# Altium project Motherboard_CMOS_MTJ_Biochip_v1.PrjPCB (part 2 of 2)

## Sheet CM Voltage Generator.SchDoc
size 406 x 203 mm
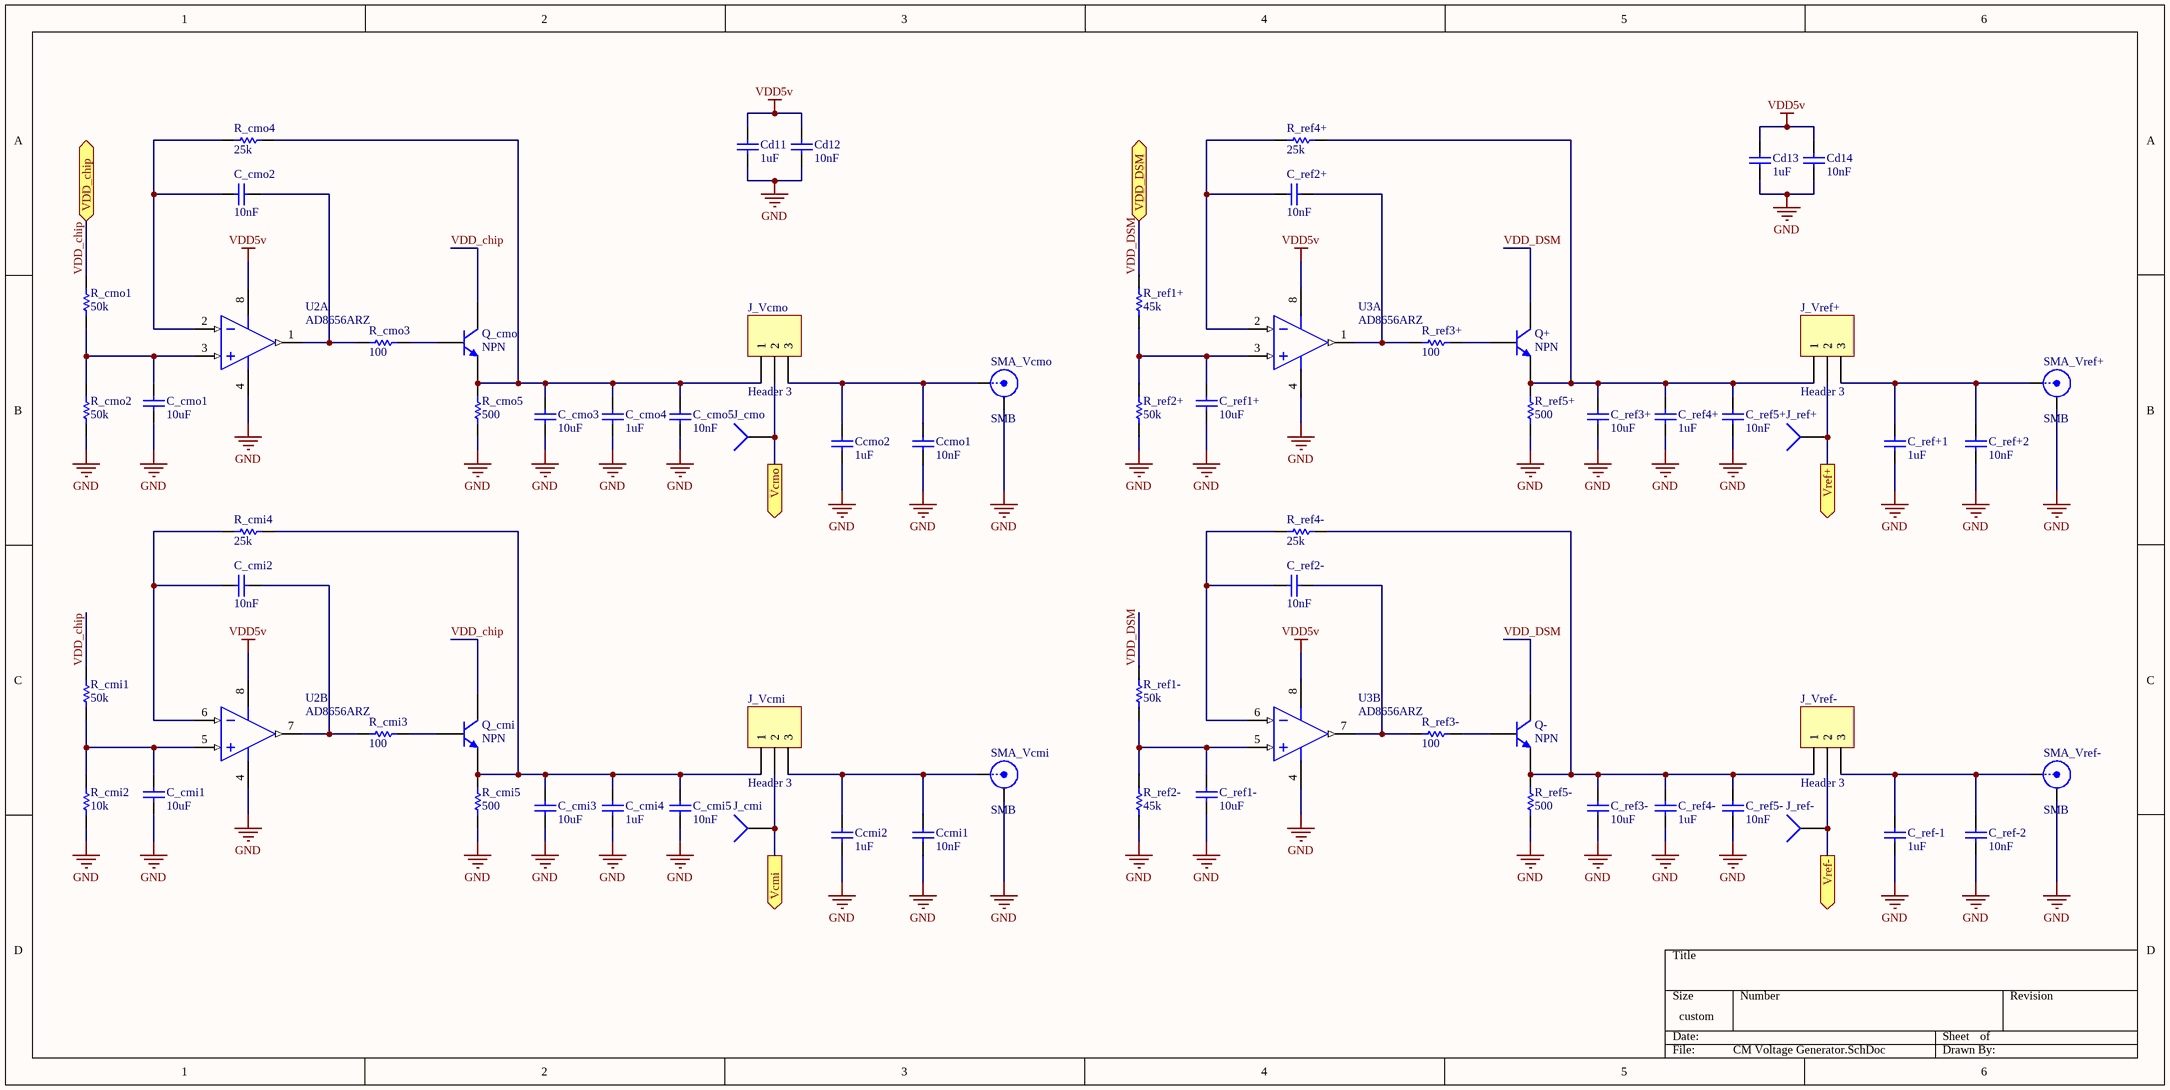
[diagram p5: CM Voltage Generator.SchDoc]

### Parts
C_cmi1  value 10uF  [1608[0603]]  (hidden comment: Cap)
C_cmi2  value 10nF  [1608[0603]]  (hidden comment: Cap)
C_cmi3  value 10uF  [1608[0603]]  (hidden comment: Cap)
C_cmi4  value 1uF  [1608[0603]]  (hidden comment: Cap)
C_cmi5  value 10nF  [1608[0603]]  (hidden comment: Cap)
C_cmo1  value 10uF  [1608[0603]]  (hidden comment: Cap)
C_cmo2  value 10nF  [1608[0603]]  (hidden comment: Cap)
C_cmo3  value 10uF  [1608[0603]]  (hidden comment: Cap)
C_cmo4  value 1uF  [1608[0603]]  (hidden comment: Cap)
C_cmo5  value 10nF  [1608[0603]]  (hidden comment: Cap)
C_ref1+  value 10uF  [1608[0603]]  (hidden comment: Cap)
C_ref1-  value 10uF  [1608[0603]]  (hidden comment: Cap)
C_ref2+  value 10nF  [1608[0603]]  (hidden comment: Cap)
C_ref2-  value 10nF  [1608[0603]]  (hidden comment: Cap)
C_ref3+  value 10uF  [1608[0603]]  (hidden comment: Cap)
C_ref3-  value 10uF  [1608[0603]]  (hidden comment: Cap)
C_ref4+  value 1uF  [1608[0603]]  (hidden comment: Cap)
C_ref4-  value 1uF  [1608[0603]]  (hidden comment: Cap)
C_ref5+  value 10nF  [1608[0603]]  (hidden comment: Cap)
C_ref5-  value 10nF  [1608[0603]]  (hidden comment: Cap)
C_ref+1  value 1uF  [1608[0603]]  (hidden comment: Cap)
C_ref+2  value 10nF  [1608[0603]]  (hidden comment: Cap)
C_ref-1  value 1uF  [1608[0603]]  (hidden comment: Cap)
C_ref-2  value 10nF  [1608[0603]]  (hidden comment: Cap)
Ccmi1  value 10nF  [1608[0603]]  (hidden comment: Cap)
Ccmi2  value 1uF  [1608[0603]]  (hidden comment: Cap)
Ccmo1  value 10nF  [1608[0603]]  (hidden comment: Cap)
Ccmo2  value 1uF  [1608[0603]]  (hidden comment: Cap)
Cd11  value 1uF  [1608[0603]]  (hidden comment: Cap)
Cd12  value 10nF  [1608[0603]]  (hidden comment: Cap)
Cd13  value 1uF  [1608[0603]]  (hidden comment: Cap)
Cd14  value 10nF  [1608[0603]]  (hidden comment: Cap)
J_cmi  Socket  [PIN1]  (value not drawn)
J_cmo  Socket  [PIN1]  (value not drawn)
J_ref+  Socket  [PIN1]  (value not drawn)
J_ref-  Socket  [PIN1]  (value not drawn)
J_Vcmi  Header 3  [HDR1X3]
J_Vcmo  Header 3  [HDR1X3]
J_Vref+  Header 3  [HDR1X3]
J_Vref-  Header 3  [HDR1X3]
Q+  NPN  [SOT-23_M]
Q-  NPN  [SOT-23_M]
Q_cmi  NPN  [SOT-23_M]
Q_cmo  NPN  [SOT-23_M]
R_cmi1  value 50k  [1608[0603]]  (hidden comment: Res1)
R_cmi2  value 10k  [1608[0603]]  (hidden comment: Res1)
R_cmi3  value 100  [1608[0603]]  (hidden comment: Res1)
R_cmi4  value 25k  [1608[0603]]  (hidden comment: Res1)
R_cmi5  value 500  [1608[0603]]  (hidden comment: Res1)
R_cmo1  value 50k  [1608[0603]]  (hidden comment: Res1)
R_cmo2  value 50k  [1608[0603]]  (hidden comment: Res1)
R_cmo3  value 100  [1608[0603]]  (hidden comment: Res1)
R_cmo4  value 25k  [1608[0603]]  (hidden comment: Res1)
R_cmo5  value 500  [1608[0603]]  (hidden comment: Res1)
R_ref1+  value 45k  [1608[0603]]  (hidden comment: Res1)
R_ref1-  value 50k  [1608[0603]]  (hidden comment: Res1)
R_ref2+  value 50k  [1608[0603]]  (hidden comment: Res1)
R_ref2-  value 45k  [1608[0603]]  (hidden comment: Res1)
R_ref3+  value 100  [1608[0603]]  (hidden comment: Res1)
R_ref3-  value 100  [1608[0603]]  (hidden comment: Res1)
R_ref4+  value 25k  [1608[0603]]  (hidden comment: Res1)
R_ref4-  value 25k  [1608[0603]]  (hidden comment: Res1)
R_ref5+  value 500  [1608[0603]]  (hidden comment: Res1)
R_ref5-  value 500  [1608[0603]]  (hidden comment: Res1)
SMA_Vcmi  SMB  [SMB_V-RJ45]
SMA_Vcmo  SMB  [SMB_V-RJ45]
SMA_Vref+  SMB  [SMB_V-RJ45]
SMA_Vref-  SMB  [SMB_V-RJ45]
U2  AD8656ARZ  [ADI-R-8_N]  (parts A,B of 2)
U3  AD8656ARZ  [ADI-R-8_N]  (parts A,B of 2)

### Ports
Vcmi (out), Vcmo (out), VDD_chip (bidir), VDD_DSM (bidir), Vref+ (out), Vref- (out)

### Nets
GND: C_cmi1.2 C_cmi3.2 C_cmi4.2 C_cmi5.2 C_cmo1.2 C_cmo3.2 C_cmo4.2 C_cmo5.2 C_ref1+.2 C_ref1-.2 C_ref3+.2 C_ref3-.2 C_ref4+.2 C_ref4-.2 C_ref5+.2 C_ref5-.2 C_ref+1.2 C_ref+2.2 C_ref-1.2 C_ref-2.2 Ccmi1.2 Ccmi2.2 Ccmo1.2 Ccmo2.2 Cd11.2 Cd12.2 Cd13.2 Cd14.2 R_cmi2.1 R_cmi5.2 R_cmo2.1 R_cmo5.2 R_ref2+.1 R_ref2-.1 R_ref5+.2 R_ref5-.2 SMA_Vcmi.2(Y) SMA_Vcmo.2(Y) SMA_Vref+.2(Y) SMA_Vref-.2(Y) U2.4(-V) U3.4(-V)
VDD5v: Cd11.1 Cd12.1 Cd13.1 Cd14.1 U2.8(+V) U3.8(+V)
Vcmi: J_cmi.1 J_Vcmi.2 ; port Vcmi
Vcmo: J_cmo.1 J_Vcmo.2 ; port Vcmo
VDD_chip: Q_cmi.1(C) Q_cmo.1(C) R_cmi1.2 R_cmo1.2 ; port VDD_chip
VDD_DSM: Q+.1(C) Q-.1(C) R_ref1+.2 R_ref1-.2 ; port VDD_DSM
Vref+: J_ref+.1 J_Vref+.2 ; port Vref+
Vref-: J_ref-.1 J_Vref-.2 ; port Vref-
NetC_cmi1_1: C_cmi1.1 R_cmi1.1 R_cmi2.2 U2.5(+IN_B)
NetC_cmi2_1: C_cmi2.1 R_cmi4.2 U2.6(-IN_B)
NetC_cmi2_2: C_cmi2.2 R_cmi3.2 U2.7(OUT_B)
NetC_cmi3_1: C_cmi3.1 C_cmi4.1 C_cmi5.1 J_Vcmi.1 Q_cmi.3(E) R_cmi4.1 R_cmi5.1
NetC_cmo1_1: C_cmo1.1 R_cmo1.1 R_cmo2.2 U2.3(+IN_A)
NetC_cmo2_1: C_cmo2.1 R_cmo4.2 U2.2(-IN_A)
NetC_cmo2_2: C_cmo2.2 R_cmo3.2 U2.1(OUT_A)
NetC_cmo3_1: C_cmo3.1 C_cmo4.1 C_cmo5.1 J_Vcmo.1 Q_cmo.3(E) R_cmo4.1 R_cmo5.1
NetC_ref1+_1: C_ref1+.1 R_ref1+.1 R_ref2+.2 U3.3(+IN_A)
NetC_ref1-_1: C_ref1-.1 R_ref1-.1 R_ref2-.2 U3.5(+IN_B)
NetC_ref2+_1: C_ref2+.1 R_ref4+.2 U3.2(-IN_A)
NetC_ref2+_2: C_ref2+.2 R_ref3+.2 U3.1(OUT_A)
NetC_ref2-_1: C_ref2-.1 R_ref4-.2 U3.6(-IN_B)
NetC_ref2-_2: C_ref2-.2 R_ref3-.2 U3.7(OUT_B)
NetC_ref3+_1: C_ref3+.1 C_ref4+.1 C_ref5+.1 J_Vref+.1 Q+.3(E) R_ref4+.1 R_ref5+.1
NetC_ref3-_1: C_ref3-.1 C_ref4-.1 C_ref5-.1 J_Vref-.1 Q-.3(E) R_ref4-.1 R_ref5-.1
NetC_ref+1_1: C_ref+1.1 C_ref+2.1 J_Vref+.3 SMA_Vref+.1(X)
NetC_ref-1_1: C_ref-1.1 C_ref-2.1 J_Vref-.3 SMA_Vref-.1(X)
NetCcmi1_1: Ccmi1.1 Ccmi2.1 J_Vcmi.3 SMA_Vcmi.1(X)
NetCcmo1_1: Ccmo1.1 Ccmo2.1 J_Vcmo.3 SMA_Vcmo.1(X)
NetQ+_2: Q+.2(B) R_ref3+.1
NetQ-_2: Q-.2(B) R_ref3-.1
NetQ_cmi_2: Q_cmi.2(B) R_cmi3.1
NetQ_cmo_2: Q_cmo.2(B) R_cmo3.1

### Library data of the parts
C_cmi1-C_cmi5 C_cmo1-C_cmo5 C_ref1+ C_ref1- C_ref2+ C_ref2- C_ref3+ C_ref3- C_ref4+ C_ref4- C_ref5+ C_ref5- C_ref+1 C_ref+2 C_ref-1 C_ref-2 Ccmi1 Ccmi2 Ccmo1 Ccmo2 Cd11-Cd14 = Cap: Capacitor; Published: 8-Jun-2000; LatestRevisionDate: 17-Jul-2002; LatestRevisionNote: Re-released for DXP Platform.; PackageReference: RAD-0.3; Publisher: Altium Limited; PackageDescription: Radial Cap, Thru-Hole; 2 Leads; 0.3 in Pin Spacing; Digi-Key: 445-7534-1-ND
J_Vcmi J_Vcmo J_Vref+ J_Vref- = Header 3: Header, 3-Pin; LatestRevisionDate: 17-Jul-2002; LatestRevisionNote: Re-released for DXP Platform.; Publisher: Altium Limited
Q+ Q- Q_cmi Q_cmo = NPN: NPN Bipolar Transistor; pin to pad: 1>3 2>1 3>2; Published: 8-Jun-2000; LatestRevisionDate: 17-Jul-2002; LatestRevisionNote: Re-released for DXP Platform.; PackageReference: TO-226-AA; Publisher: Altium Limited; PackageDescription: TO, Flat Index; 3 In-Line, Axial Leads; Body Dia. 4.8mm; Leads 0.55 x 0.51 mm (max); Code_JEDEC: TO-226-AA
R_cmi1-R_cmi5 R_cmo1-R_cmo5 R_ref1+ R_ref1- R_ref2+ R_ref2- R_ref3+ R_ref3- R_ref4+ R_ref4- R_ref5+ R_ref5- = Res1: Resistor; Published: 8-Jun-2000; LatestRevisionDate: 17-Jul-2002; LatestRevisionNote: Re-released for DXP Platform.; PackageReference: AXIAL-0.3; Publisher: Altium Limited; PackageDescription: Axial Device, Thru-Hole; 2 Leads; 0.3 in Pin Spacing; Digikey PN: P1.00KCCT-ND
SMA_Vcmi SMA_Vcmo SMA_Vref+ SMA_Vref- = SMB: SMB Straight Connector; LatestRevisionDate: 17-Jul-2002; LatestRevisionNote: Re-released for DXP Platform.; Publisher: Altium Limited
U2 U3 = AD8656ARZ: Double Channel RRIO Operational Amplifier, 28 MHz BW, 11 V/us SR, Industrial, 8-pin SOIC (R-8), Tube; Generic Part Number: AD8656; Manufacturer: Analog Devices; Amplifiers Per Package: 2; Automotive Qualified: Yes; Input Bias Current: 1pA; Input Offset Voltage: 50uV; Iq/Amp: 4.5mA; Slew Rate: 11V/us; Small Signal Bandwidth: 28MHz; V Span Max: 5.5V; V Span Min: 2.7V; DatasheetVersion: Rev. B; PackageVersion: 060506-A; PackageReference: R-8; PackageDescription: 8-Pin Standard Small Outline Package, Body 3.9 x 4.9 mm, Pitch 1.27 mm; Supplier 1: Digi-Key; Supplier Part Number 1: AD8656ARZ-ND; Supplier 2: Farnell; Supplier Part Number 2: 1117887; Supplier 3: Newark; Supplier Part Number 3: 19M0993; Mounting Technology: Surface Mount; Code_JEDEC: MS-012-AA; PartNumber: AD8656ARZ; ComponentLink1Description: Manufacturer URL; ComponentLink1URL: http://www.analog.com/en/index.html; ComponentLink2Description: Datasheet; ComponentLink2URL: http://www.analog.com/static/imported-files/data_sheets/AD8655_8656.pdf; ComponentLink3Description: Package Specification; ComponentLink3URL: http://www.analog.com/static/imported-files/packages/PKG_PDF/SOIC_Narrow%20(R)/R_8.pdf
J_cmi J_cmo J_ref+ J_ref- = Socket: LatestRevisionDate: 17-Jul-2002; LatestRevisionNote: Re-released for DXP Platform.; Publisher: Altium Limited

## Sheet Level_Shifter.SchDoc
size A
Used 2 times, as channels Level_Shifter_Clk, Level_Shifter_Stripline. Parts and nets are listed once, with the designators drawn on the sheet.
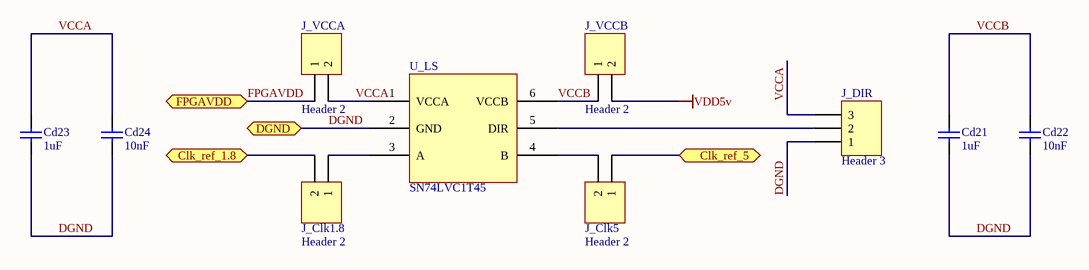
[diagram p6: Level_Shifter.SchDoc]

### Parts
Cd21  value 1uF  [1608[0603]]  (hidden comment: Cap)
Cd22  value 10nF  [1608[0603]]  (hidden comment: Cap)
Cd23  value 1uF  [1608[0603]]  (hidden comment: Cap)
Cd24  value 10nF  [1608[0603]]  (hidden comment: Cap)
J_Clk1.8  Header 2  [HDR1X2]
J_Clk5  Header 2  [HDR1X2]
J_DIR  Header 3  [HDR1X3]
J_VCCA  Header 2  [HDR1X2]
J_VCCB  Header 2  [HDR1X2]
U_LS  SN74LVC1T45  [SO-G6/P.95]

### Ports
Clk_ref_1.8 (bidir), Clk_ref_5 (bidir), DGND (bidir), FPGAVDD (bidir)

### Nets
VDD5v: J_VCCB.2
Clk_ref_1.8: J_Clk1.8.2 ; port Clk_ref_1.8
Clk_ref_5: J_Clk5.1 ; port Clk_ref_5
DGND: Cd21.2 Cd22.2 Cd23.2 Cd24.2 J_DIR.1 U_LS.2(GND) ; port DGND
FPGAVDD: J_VCCA.1 ; port FPGAVDD
VCCA: Cd23.1 Cd24.1 J_DIR.3 J_VCCA.2 U_LS.1(VCCA)
VCCB: Cd21.1 Cd22.1 J_VCCB.1 U_LS.6(VCCB)
NetJ_Clk1.8_1: J_Clk1.8.1 U_LS.3(A)
NetJ_Clk5_2: J_Clk5.2 U_LS.4(B)
NetJ_DIR_2: J_DIR.2 U_LS.5(DIR)

### Channels
Level_Shifter_Clk: designators end in _Level_Shifter_Clk; ports Clk_ref_1.8=Clk_ref_1.8 Clk_ref_5=Clk_ref_5 DGND=DGND FPGAVDD=FPGAVDD
Level_Shifter_Stripline: designators end in _Level_Shifter_Stripline; ports Clk_ref_1.8=Clk_stripe Clk_ref_5=Clk_strip5v DGND=DGND FPGAVDD=FPGAVDD

### Library data of the parts
Cd21-Cd24 = Cap: Capacitor; Published: 8-Jun-2000; LatestRevisionDate: 17-Jul-2002; LatestRevisionNote: Re-released for DXP Platform.; PackageReference: RAD-0.3; Publisher: Altium Limited; PackageDescription: Radial Cap, Thru-Hole; 2 Leads; 0.3 in Pin Spacing; Digi-Key: 445-7534-1-ND
J_Clk1.8 J_Clk5 J_VCCA J_VCCB = Header 2: Header, 2-Pin; LatestRevisionDate: 17-Jul-2002; LatestRevisionNote: Re-released for DXP Platform.; Publisher: Altium Limited
J_DIR = Header 3: Header, 3-Pin; LatestRevisionDate: 17-Jul-2002; LatestRevisionNote: Re-released for DXP Platform.; Publisher: Altium Limited

## Sheet Analog_Buffer.SchDoc
size A
Used 23 times, as channels Analog_Buffer1, Analog_Buffer2, Analog_Buffer3, Analog_Buffer4, Analog_Buffer5, Analog_Buffer6, Analog_Buffer7, Analog_Buffer8, Analog_Buffer9, Analog_Buffer10, Analog_Buffer11, Analog_Buffer12, Analog_Buffer13, Analog_Buffer14, Analog_Buffer15, Analog_Buffer16, Analog_Buffer17, Analog_Buffer18, Analog_Buffer19, Analog_Buffer20, Analog_Buffer21, Analog_Buffer22, Analog_Buffer23. Parts and nets are listed once, with the designators drawn on the sheet.
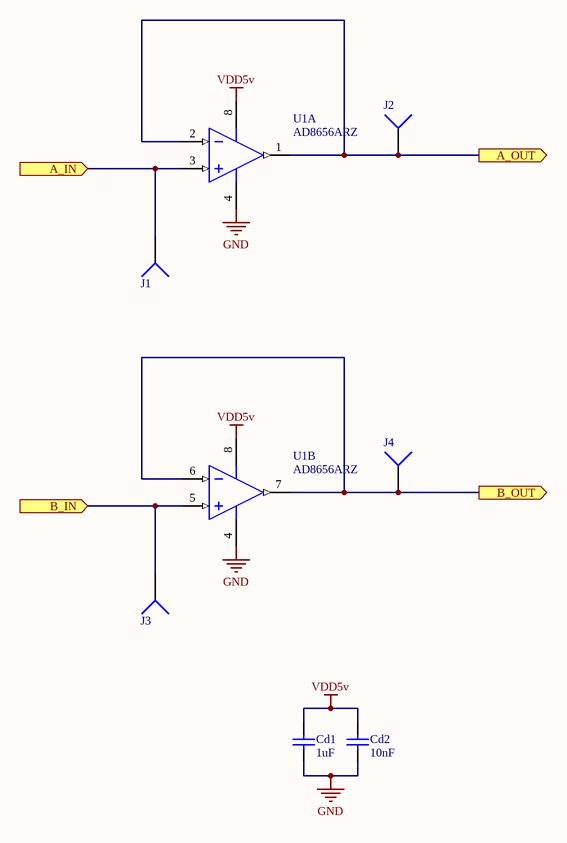
[diagram p7: Analog_Buffer.SchDoc]

### Parts
Cd1  value 1uF  [1608[0603]]  (hidden comment: Cap)
Cd2  value 10nF  [1608[0603]]  (hidden comment: Cap)
J1  Socket  [PIN1]  (value not drawn)
J2  Socket  [PIN1]  (value not drawn)
J3  Socket  [PIN1]  (value not drawn)
J4  Socket  [PIN1]  (value not drawn)
U1  AD8656ARZ  [ADI-R-8_N]  (parts A,B of 2)

### Ports
A_IN (in), A_OUT (out), B_IN (in), B_OUT (out)

### Nets
GND: Cd1.2 Cd2.2 U1.4(-V)
VDD5v: Cd1.1 Cd2.1 U1.8(+V)
A_IN: J1.1 U1.3(+IN_A) ; port A_IN
A_OUT: J2.1 U1.1(OUT_A) U1.2(-IN_A) ; port A_OUT
B_IN: J3.1 U1.5(+IN_B) ; port B_IN
B_OUT: J4.1 U1.6(-IN_B) U1.7(OUT_B) ; port B_OUT

### Channels
Analog_Buffer1: designators end in _Analog_Buffer1; ports A_IN=A_IN1 A_OUT=A_OUT1 B_IN=B_IN1 B_OUT=B_OUT1
Analog_Buffer2: designators end in _Analog_Buffer2; ports A_IN=A_IN2 A_OUT=A_OUT2 B_IN=B_IN2 B_OUT=B_OUT2
Analog_Buffer3: designators end in _Analog_Buffer3; ports A_IN=A_IN3 A_OUT=A_OUT3 B_IN=B_IN3 B_OUT=B_OUT3
Analog_Buffer4: designators end in _Analog_Buffer4; ports A_IN=A_IN4 A_OUT=A_OUT4 B_IN=B_IN4 B_OUT=B_OUT4
Analog_Buffer5: designators end in _Analog_Buffer5; ports A_IN=A_IN5 A_OUT=A_OUT5 B_IN=B_IN5 B_OUT=B_OUT5
Analog_Buffer6: designators end in _Analog_Buffer6; ports A_IN=A_IN6 A_OUT=A_OUT6 B_IN=B_IN6 B_OUT=B_OUT6
Analog_Buffer7: designators end in _Analog_Buffer7; ports A_IN=A_IN7 A_OUT=A_OUT7 B_IN=B_IN7 B_OUT=B_OUT7
Analog_Buffer8: designators end in _Analog_Buffer8; ports A_IN=A_IN8 A_OUT=A_OUT8 B_IN=B_IN8 B_OUT=B_OUT8
Analog_Buffer9: designators end in _Analog_Buffer9; ports A_IN=A_IN9 A_OUT=A_OUT9 B_IN=B_IN9 B_OUT=B_OUT9
Analog_Buffer10: designators end in _Analog_Buffer10; ports A_IN=A_IN10 A_OUT=A_OUT10 B_IN=B_IN10 B_OUT=B_OUT10
Analog_Buffer11: designators end in _Analog_Buffer11; ports A_IN=A_IN11 A_OUT=A_OUT11 B_IN=B_IN11 B_OUT=B_OUT11
Analog_Buffer12: designators end in _Analog_Buffer12; ports A_IN=A_IN12 A_OUT=A_OUT12 B_IN=B_IN12 B_OUT=B_OUT12
Analog_Buffer13: designators end in _Analog_Buffer13; ports A_IN=A_IN13 A_OUT=A_OUT13 B_IN=B_IN13 B_OUT=B_OUT13
Analog_Buffer14: designators end in _Analog_Buffer14; ports A_IN=A_IN14 A_OUT=A_OUT14 B_IN=B_IN14 B_OUT=B_OUT14
Analog_Buffer15: designators end in _Analog_Buffer15; ports A_IN=A_IN15 A_OUT=A_OUT15 B_IN=B_IN15 B_OUT=B_OUT15
Analog_Buffer16: designators end in _Analog_Buffer16; ports A_IN=A_IN16 A_OUT=A_OUT16 B_IN=B_IN16 B_OUT=B_OUT16
Analog_Buffer17: designators end in _Analog_Buffer17; ports A_IN=A_IN17 A_OUT=A_OUT17 B_IN=B_IN17 B_OUT=B_OUT17
Analog_Buffer18: designators end in _Analog_Buffer18; ports A_IN=A_IN18 A_OUT=A_OUT18 B_IN=B_IN18 B_OUT=B_OUT18
Analog_Buffer19: designators end in _Analog_Buffer19; ports A_IN=A_IN19 A_OUT=A_OUT19 B_IN=B_IN19 B_OUT=B_OUT19
Analog_Buffer20: designators end in _Analog_Buffer20; ports A_IN=A_IN20 A_OUT=A_OUT20 B_IN=B_IN20 B_OUT=B_OUT20
Analog_Buffer21: designators end in _Analog_Buffer21; ports A_IN=A_IN21 A_OUT=A_OUT21 B_IN=B_IN21 B_OUT=B_OUT21
Analog_Buffer22: designators end in _Analog_Buffer22; ports A_IN=A_IN22 A_OUT=A_OUT22 B_IN=B_IN22 B_OUT=B_OUT22
Analog_Buffer23: designators end in _Analog_Buffer23; ports A_IN=A_IN23 A_OUT=A_OUT23 B_IN=B_IN23 B_OUT=B_OUT23

### Library data of the parts
Cd1 Cd2 = Cap: Capacitor; Published: 8-Jun-2000; LatestRevisionDate: 17-Jul-2002; LatestRevisionNote: Re-released for DXP Platform.; PackageReference: RAD-0.3; Publisher: Altium Limited; PackageDescription: Radial Cap, Thru-Hole; 2 Leads; 0.3 in Pin Spacing; Digi-Key: 445-7534-1-ND
U1 = AD8656ARZ: Double Channel RRIO Operational Amplifier, 28 MHz BW, 11 V/us SR, Industrial, 8-pin SOIC (R-8), Tube; Generic Part Number: AD8656; Manufacturer: Analog Devices; Amplifiers Per Package: 2; Automotive Qualified: Yes; Input Bias Current: 1pA; Input Offset Voltage: 50uV; Iq/Amp: 4.5mA; Slew Rate: 11V/us; Small Signal Bandwidth: 28MHz; V Span Max: 5.5V; V Span Min: 2.7V; DatasheetVersion: Rev. B; PackageVersion: 060506-A; PackageReference: R-8; PackageDescription: 8-Pin Standard Small Outline Package, Body 3.9 x 4.9 mm, Pitch 1.27 mm; Supplier 1: Digi-Key; Supplier Part Number 1: AD8656ARZ-ND; Supplier 2: Farnell; Supplier Part Number 2: 1117887; Supplier 3: Newark; Supplier Part Number 3: 19M0993; Mounting Technology: Surface Mount; Code_JEDEC: MS-012-AA; PartNumber: AD8656ARZ; ComponentLink1Description: Manufacturer URL; ComponentLink1URL: http://www.analog.com/en/index.html; ComponentLink2Description: Datasheet; ComponentLink2URL: http://www.analog.com/static/imported-files/data_sheets/AD8655_8656.pdf; ComponentLink3Description: Package Specification; ComponentLink3URL: http://www.analog.com/static/imported-files/packages/PKG_PDF/SOIC_Narrow%20(R)/R_8.pdf
J1-J4 = Socket: LatestRevisionDate: 17-Jul-2002; LatestRevisionNote: Re-released for DXP Platform.; Publisher: Altium Limited

## Sheet Attenuator.SchDoc
size A
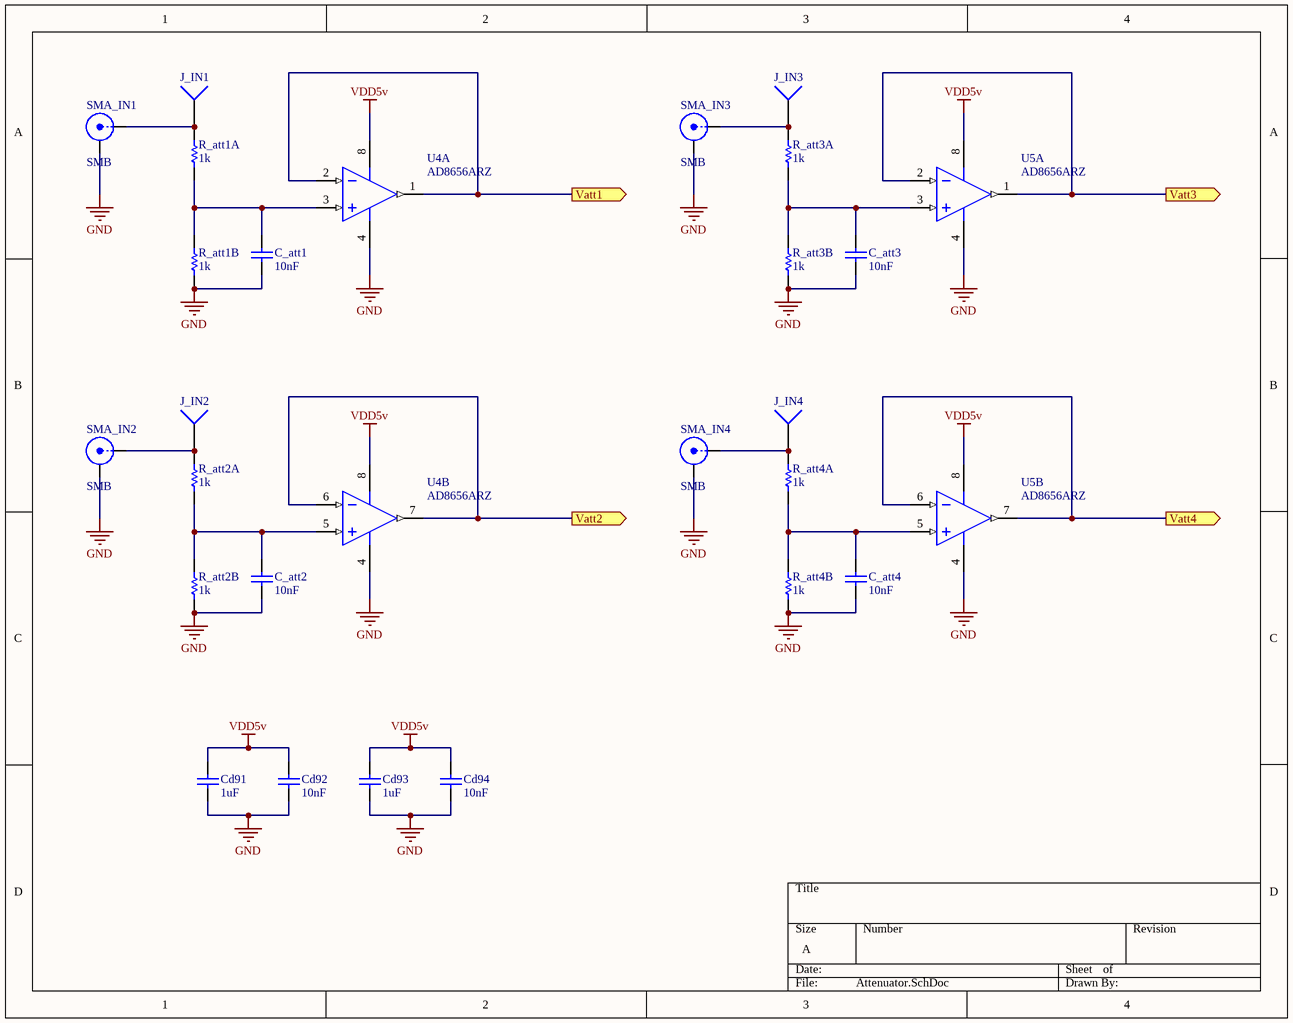
[diagram p8: Attenuator.SchDoc]

### Parts
C_att1  value 10nF  [1608[0603]]  (hidden comment: Cap)
C_att2  value 10nF  [1608[0603]]  (hidden comment: Cap)
C_att3  value 10nF  [1608[0603]]  (hidden comment: Cap)
C_att4  value 10nF  [1608[0603]]  (hidden comment: Cap)
Cd91  value 1uF  [1608[0603]]  (hidden comment: Cap)
Cd92  value 10nF  [1608[0603]]  (hidden comment: Cap)
Cd93  value 1uF  [1608[0603]]  (hidden comment: Cap)
Cd94  value 10nF  [1608[0603]]  (hidden comment: Cap)
J_IN1  Socket  [PIN1]  (value not drawn)
J_IN2  Socket  [PIN1]  (value not drawn)
J_IN3  Socket  [PIN1]  (value not drawn)
J_IN4  Socket  [PIN1]  (value not drawn)
R_att1A  value 1k  [1608[0603]]  (hidden comment: Res1)
R_att1B  value 1k  [1608[0603]]  (hidden comment: Res1)
R_att2A  value 1k  [1608[0603]]  (hidden comment: Res1)
R_att2B  value 1k  [1608[0603]]  (hidden comment: Res1)
R_att3A  value 1k  [1608[0603]]  (hidden comment: Res1)
R_att3B  value 1k  [1608[0603]]  (hidden comment: Res1)
R_att4A  value 1k  [1608[0603]]  (hidden comment: Res1)
R_att4B  value 1k  [1608[0603]]  (hidden comment: Res1)
SMA_IN1  SMB  [SMB_V-RJ45]
SMA_IN2  SMB  [SMB_V-RJ45]
SMA_IN3  SMB  [SMB_V-RJ45]
SMA_IN4  SMB  [SMB_V-RJ45]
U4  AD8656ARZ  [ADI-R-8_N]  (parts A,B of 2)
U5  AD8656ARZ  [ADI-R-8_N]  (parts A,B of 2)

### Ports
Vatt1 (out), Vatt2 (out), Vatt3 (out), Vatt4 (out)

### Nets
GND: C_att1.2 C_att2.2 C_att3.2 C_att4.2 Cd91.2 Cd92.2 Cd93.2 Cd94.2 R_att1B.1 R_att2B.1 R_att3B.1 R_att4B.1 SMA_IN1.2(Y) SMA_IN2.2(Y) SMA_IN3.2(Y) SMA_IN4.2(Y) U4.4(-V) U5.4(-V)
VDD5v: Cd91.1 Cd92.1 Cd93.1 Cd94.1 U4.8(+V) U5.8(+V)
NetC_att1_1: C_att1.1 R_att1A.1 R_att1B.2 U4.3(+IN_A)
NetC_att2_1: C_att2.1 R_att2A.1 R_att2B.2 U4.5(+IN_B)
NetC_att3_1: C_att3.1 R_att3A.1 R_att3B.2 U5.3(+IN_A)
NetC_att4_1: C_att4.1 R_att4A.1 R_att4B.2 U5.5(+IN_B)
NetJ_att1_1: U4.1(OUT_A) U4.2(-IN_A) ; port Vatt1
NetJ_att2_1: U4.6(-IN_B) U4.7(OUT_B) ; port Vatt2
NetJ_att3_1: U5.1(OUT_A) U5.2(-IN_A) ; port Vatt3
NetJ_att4_1: U5.6(-IN_B) U5.7(OUT_B) ; port Vatt4
NetJ_IN1_1: J_IN1.1 R_att1A.2 SMA_IN1.1(X)
NetJ_IN2_1: J_IN2.1 R_att2A.2 SMA_IN2.1(X)
NetJ_IN3_1: J_IN3.1 R_att3A.2 SMA_IN3.1(X)
NetJ_IN4_1: J_IN4.1 R_att4A.2 SMA_IN4.1(X)

### Library data of the parts
C_att1-C_att4 Cd91-Cd94 = Cap: Capacitor; Published: 8-Jun-2000; LatestRevisionDate: 17-Jul-2002; LatestRevisionNote: Re-released for DXP Platform.; PackageReference: RAD-0.3; Publisher: Altium Limited; PackageDescription: Radial Cap, Thru-Hole; 2 Leads; 0.3 in Pin Spacing; Digi-Key: 445-7534-1-ND
R_att1A R_att1B R_att2A R_att2B R_att3A R_att3B R_att4A R_att4B = Res1: Resistor; Published: 8-Jun-2000; LatestRevisionDate: 17-Jul-2002; LatestRevisionNote: Re-released for DXP Platform.; PackageReference: AXIAL-0.3; Publisher: Altium Limited; PackageDescription: Axial Device, Thru-Hole; 2 Leads; 0.3 in Pin Spacing; Digikey PN: P1.00KCCT-ND
SMA_IN1-SMA_IN4 = SMB: SMB Straight Connector; LatestRevisionDate: 17-Jul-2002; LatestRevisionNote: Re-released for DXP Platform.; Publisher: Altium Limited
U4 U5 = AD8656ARZ: as U1 on sheet Analog_Buffer; DatasheetVersion: Rev. B; PackageVersion: 060506-A; PackageReference: R-8; PackageDescription: 8-Pin Standard Small Outline Package, Body 3.9 x 4.9 mm, Pitch 1.27 mm; Supplier 1: Digi-Key; Supplier Part Number 1: AD8656ARZ-ND; Supplier 2: Farnell; Supplier Part Number 2: 1117887; Supplier 3: Newark; Supplier Part Number 3: 19M0993; Mounting Technology: Surface Mount; Code_JEDEC: MS-012-AA; PartNumber: AD8656ARZ; ComponentLink1Description: Manufacturer URL; ComponentLink1URL: http://www.analog.com/en/index.html; ComponentLink2Description: Datasheet; ComponentLink2URL: http://www.analog.com/static/imported-files/data_sheets/AD8655_8656.pdf; ComponentLink3Description: Package Specification; ComponentLink3URL: http://www.analog.com/static/imported-files/packages/PKG_PDF/SOIC_Narrow%20(R)/R_8.pdf
J_IN1-J_IN4 = Socket: LatestRevisionDate: 17-Jul-2002; LatestRevisionNote: Re-released for DXP Platform.; Publisher: Altium Limited

## Sheet Stripline_Driver.SchDoc
size A
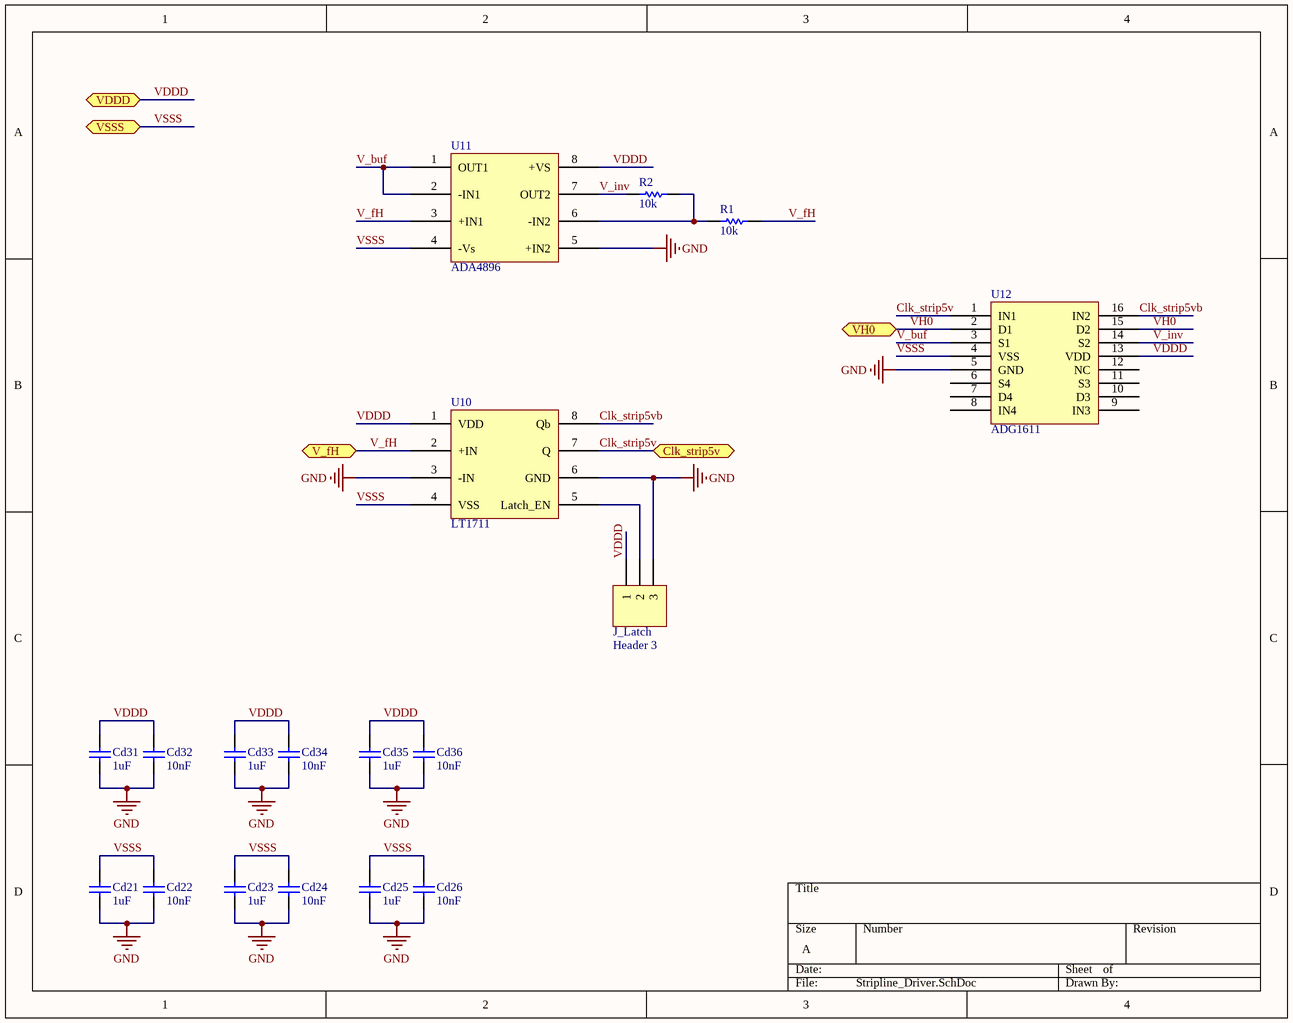
[diagram p9: Stripline_Driver.SchDoc]

### Parts
Cd21  value 1uF  [1608[0603]]  (hidden comment: Cap)
Cd22  value 10nF  [1608[0603]]  (hidden comment: Cap)
Cd23  value 1uF  [1608[0603]]  (hidden comment: Cap)
Cd24  value 10nF  [1608[0603]]  (hidden comment: Cap)
Cd25  value 1uF  [1608[0603]]  (hidden comment: Cap)
Cd26  value 10nF  [1608[0603]]  (hidden comment: Cap)
Cd31  value 1uF  [1608[0603]]  (hidden comment: Cap)
Cd32  value 10nF  [1608[0603]]  (hidden comment: Cap)
Cd33  value 1uF  [1608[0603]]  (hidden comment: Cap)
Cd34  value 10nF  [1608[0603]]  (hidden comment: Cap)
Cd35  value 1uF  [1608[0603]]  (hidden comment: Cap)
Cd36  value 10nF  [1608[0603]]  (hidden comment: Cap)
J_Latch  Header 3  [HDR1X3]
R1  value 10k  [1608[0603]]  (hidden comment: Res1)
R2  value 10k  [1608[0603]]  (hidden comment: Res1)
U10  LT1711  [RM-8]
U11  ADA4896  [RM-8]
U12  ADG1611  [RU-16]

### Ports
Clk_strip5v (bidir), V_fH (bidir), VDDD (bidir), VH0 (bidir), VSSS (bidir)

### Nets
GND: Cd21.2 Cd22.2 Cd23.2 Cd24.2 Cd25.2 Cd26.2 Cd31.2 Cd32.2 Cd33.2 Cd34.2 Cd35.2 Cd36.2 J_Latch.3 U10.3(-IN) U10.6(GND) U11.5(+IN2) U12.5(GND)
Clk_strip5v: U10.7(Q) U12.1(IN1) ; port Clk_strip5v
Clk_strip5vb: U10.8(Qb) U12.16(IN2)
V_buf: U11.1(OUT1) U11.2(-IN1) U12.3(S1)
V_fH: R1.2 U10.2(+IN) U11.3(+IN1) ; port V_fH
V_inv: R2.2 U11.7(OUT2) U12.14(S2)
VDDD: Cd31.1 Cd32.1 Cd33.1 Cd34.1 Cd35.1 Cd36.1 J_Latch.1 U10.1(VDD) U11.8(+VS) U12.13(VDD) ; port VDDD
VH0: U12.2(D1) U12.15(D2) ; port VH0
VSSS: Cd21.1 Cd22.1 Cd23.1 Cd24.1 Cd25.1 Cd26.1 U10.4(VSS) U11.4(-Vs) U12.4(VSS) ; port VSSS
NetJ_Latch_2: J_Latch.2 U10.5(Latch_EN)
NetR1_1: R1.1 R2.1 U11.6(-IN2)

Not connected (* = marked no-connect by the designer): U12 6(S4) 7(D4) 8(IN4) 9(IN3) 10(D3) 11(S3) 12(NC)

### Library data of the parts
Cd21-Cd26 Cd31-Cd36 = Cap: Capacitor; Published: 8-Jun-2000; LatestRevisionDate: 17-Jul-2002; LatestRevisionNote: Re-released for DXP Platform.; PackageReference: RAD-0.3; Publisher: Altium Limited; PackageDescription: Radial Cap, Thru-Hole; 2 Leads; 0.3 in Pin Spacing; Digi-Key: 445-7534-1-ND
J_Latch = Header 3: Header, 3-Pin; LatestRevisionDate: 17-Jul-2002; LatestRevisionNote: Re-released for DXP Platform.; Publisher: Altium Limited
R1 R2 = Res1: Resistor; Published: 8-Jun-2000; LatestRevisionDate: 17-Jul-2002; LatestRevisionNote: Re-released for DXP Platform.; PackageReference: AXIAL-0.3; Publisher: Altium Limited; PackageDescription: Axial Device, Thru-Hole; 2 Leads; 0.3 in Pin Spacing; Digikey PN: P1.00KCCT-ND
U11 = ADA4862

## Sheet Bias_Current_Source.SchDoc
size 228 x 152 mm
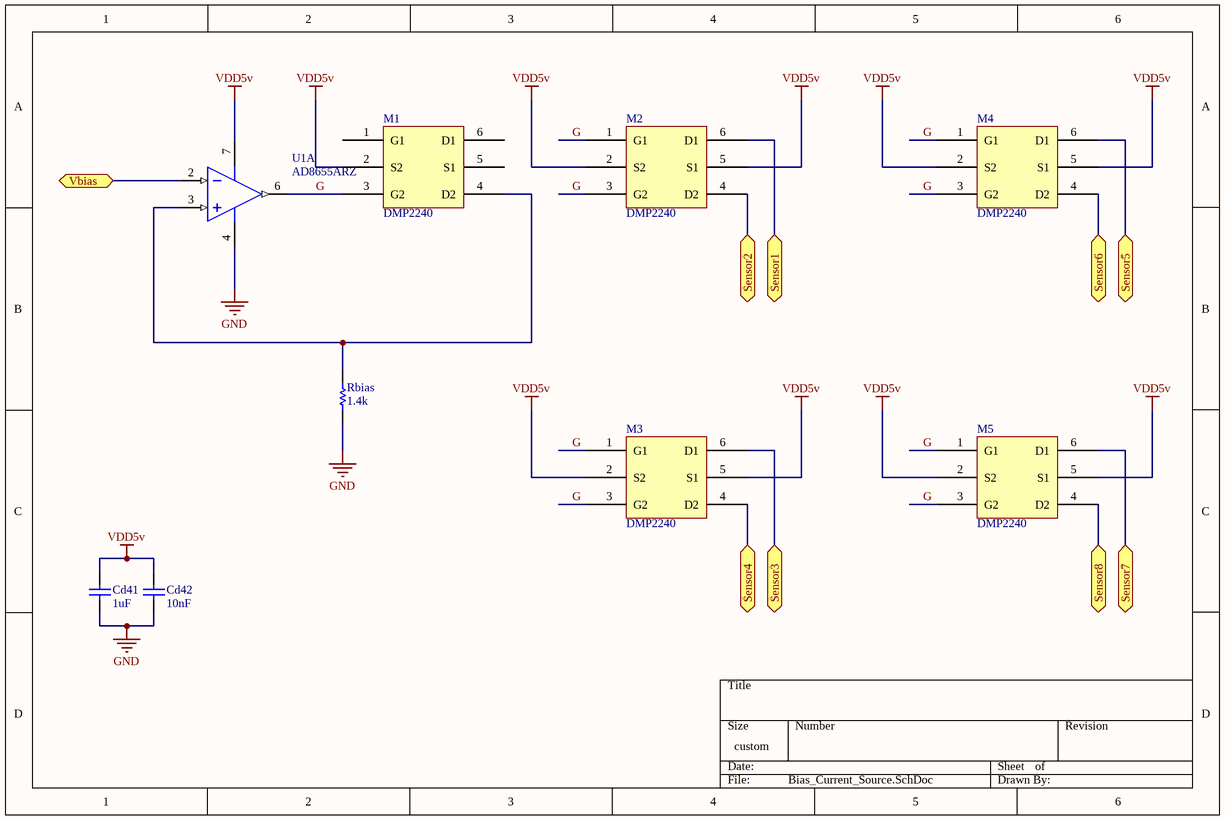
[diagram p10: Bias_Current_Source.SchDoc]

### Parts
Cd41  value 1uF  [1608[0603]]  (hidden comment: Cap)
Cd42  value 10nF  [1608[0603]]  (hidden comment: Cap)
M1  DMP2240  [SO-G6/E2.4]
M2  DMP2240  [SO-G6/E2.4]
M3  DMP2240  [SO-G6/E2.4]
M4  DMP2240  [SO-G6/E2.4]
M5  DMP2240  [SO-G6/E2.4]
Rbias  value 1.4k  [1608[0603]]  (hidden comment: Res1)
U1  AD8655ARZ  [ADI-R-8_N]  (part A of 2)

### Ports
Sensor1 (bidir), Sensor2 (bidir), Sensor3 (bidir), Sensor4 (bidir), Sensor5 (bidir), Sensor6 (bidir), Sensor7 (bidir), Sensor8 (bidir), Vbias (bidir)

### Nets
GND: Cd41.2 Cd42.2 Rbias.2 U1.4(-V)
VDD5v: Cd41.1 Cd42.1 M1.2(S2) M2.2(S2) M2.5(S1) M3.2(S2) M3.5(S1) M4.2(S2) M4.5(S1) M5.2(S2) M5.5(S1) U1.7(+V)
G: M1.3(G2) M2.1(G1) M2.3(G2) M3.1(G1) M3.3(G2) M4.1(G1) M4.3(G2) M5.1(G1) M5.3(G2) U1.6(OUT)
R1: M2.6(D1) ; port Sensor1
R2: M2.4(D2) ; port Sensor2
R3: M3.6(D1) ; port Sensor3
R4: M3.4(D2) ; port Sensor4
R5: M4.6(D1) ; port Sensor5
R6: M4.4(D2) ; port Sensor6
R7: M5.6(D1) ; port Sensor7
R8: M5.4(D2) ; port Sensor8
NetM1_4: M1.4(D2) Rbias.1 U1.3(+IN)
NetU1_2: U1.2(-IN) ; port Vbias

Not connected (* = marked no-connect by the designer): M1 1(G1) 5(S1) 6(D1)

### Library data of the parts
Cd41 Cd42 = Cap: Capacitor; Published: 8-Jun-2000; LatestRevisionDate: 17-Jul-2002; LatestRevisionNote: Re-released for DXP Platform.; PackageReference: RAD-0.3; Publisher: Altium Limited; PackageDescription: Radial Cap, Thru-Hole; 2 Leads; 0.3 in Pin Spacing; Digi-Key: 445-7534-1-ND
Rbias = Res1: Resistor; Published: 8-Jun-2000; LatestRevisionDate: 17-Jul-2002; LatestRevisionNote: Re-released for DXP Platform.; PackageReference: AXIAL-0.3; Publisher: Altium Limited; PackageDescription: Axial Device, Thru-Hole; 2 Leads; 0.3 in Pin Spacing; Digikey PN: P1.00KCCT-ND
U1 = AD8655ARZ: Single Channel Low Offset Voltage Operational Amplifier, 28 MHz BW, 11 V/us SR, Industrial, 8-pin SOIC (R-8), Tube; Generic Part Number: AD8655; Manufacturer: Analog Devices; Amplifiers Per Package: 1; Input Bias Current: 1pA; Input Offset Voltage: 50uV; Iq/Amp: 4.5mA; Slew Rate: 11V/us; Small Signal Bandwidth: 28MHz; V Span Max: 5.5V; V Span Min: 2.7V; DatasheetVersion: Rev. B; PackageVersion: 060506-A; PackageReference: R-8; PackageDescription: 8-Pin Standard Small Outline Package, Body 3.9 x 4.9 mm, Pitch 1.27 mm; Supplier 1: Digi-Key; Supplier Part Number 1: AD8655ARZ-ND; Supplier 2: Newark; Supplier Part Number 2: 59K7052; Mounting Technology: Surface Mount; Code_JEDEC: MS-012-AA; PartNumber: AD8655ARZ; ComponentLink1Description: Manufacturer URL; ComponentLink1URL: http://www.analog.com/en/index.html; ComponentLink2Description: Datasheet; ComponentLink2URL: http://www.analog.com/static/imported-files/data_sheets/AD8655_8656.pdf; ComponentLink3Description: Package Specification; ComponentLink3URL: http://www.analog.com/static/imported-files/packages/PKG_PDF/SOIC_Narrow%20(R)/R_8.pdf; ComponentLink4Description: Reference Circuit; ComponentLink4URL: http://www.analog.com/en/all-operational-amplifiers-op-amps/operational-amplifiers-op-amps/ad8655/products/product.html#product-recommendations

## Nets that join several sheets
GND: Top (104 pins), LDO (49 pins), CM Voltage Generator (42 pins), Analog_Buffer1 (Cd1_Analog_Buffer1.2 Cd2_Analog_Buffer1.2 U1_Analog_Buffer1.4), Analog_Buffer2 (Cd1_Analog_Buffer2.2 Cd2_Analog_Buffer2.2 U1_Analog_Buffer2.4), Analog_Buffer3 (Cd1_Analog_Buffer3.2 Cd2_Analog_Buffer3.2 U1_Analog_Buffer3.4), Analog_Buffer4 (Cd1_Analog_Buffer4.2 Cd2_Analog_Buffer4.2 U1_Analog_Buffer4.4), Analog_Buffer5 (Cd1_Analog_Buffer5.2 Cd2_Analog_Buffer5.2 U1_Analog_Buffer5.4), Analog_Buffer6 (Cd1_Analog_Buffer6.2 Cd2_Analog_Buffer6.2 U1_Analog_Buffer6.4), Analog_Buffer7 (Cd1_Analog_Buffer7.2 Cd2_Analog_Buffer7.2 U1_Analog_Buffer7.4), Analog_Buffer8 (Cd1_Analog_Buffer8.2 Cd2_Analog_Buffer8.2 U1_Analog_Buffer8.4), Analog_Buffer9 (Cd1_Analog_Buffer9.2 Cd2_Analog_Buffer9.2 U1_Analog_Buffer9.4), Analog_Buffer10 (Cd1_Analog_Buffer10.2 Cd2_Analog_Buffer10.2 U1_Analog_Buffer10.4), Analog_Buffer11 (Cd1_Analog_Buffer11.2 Cd2_Analog_Buffer11.2 U1_Analog_Buffer11.4), Analog_Buffer12 (Cd1_Analog_Buffer12.2 Cd2_Analog_Buffer12.2 U1_Analog_Buffer12.4), Analog_Buffer13 (Cd1_Analog_Buffer13.2 Cd2_Analog_Buffer13.2 U1_Analog_Buffer13.4), Analog_Buffer14 (Cd1_Analog_Buffer14.2 Cd2_Analog_Buffer14.2 U1_Analog_Buffer14.4), Analog_Buffer15 (Cd1_Analog_Buffer15.2 Cd2_Analog_Buffer15.2 U1_Analog_Buffer15.4), Analog_Buffer16 (Cd1_Analog_Buffer16.2 Cd2_Analog_Buffer16.2 U1_Analog_Buffer16.4), Analog_Buffer17 (Cd1_Analog_Buffer17.2 Cd2_Analog_Buffer17.2 U1_Analog_Buffer17.4), Analog_Buffer18 (Cd1_Analog_Buffer18.2 Cd2_Analog_Buffer18.2 U1_Analog_Buffer18.4), Analog_Buffer19 (Cd1_Analog_Buffer19.2 Cd2_Analog_Buffer19.2 U1_Analog_Buffer19.4), Analog_Buffer20 (Cd1_Analog_Buffer20.2 Cd2_Analog_Buffer20.2 U1_Analog_Buffer20.4), Analog_Buffer21 (Cd1_Analog_Buffer21.2 Cd2_Analog_Buffer21.2 U1_Analog_Buffer21.4), Analog_Buffer22 (Cd1_Analog_Buffer22.2 Cd2_Analog_Buffer22.2 U1_Analog_Buffer22.4), Analog_Buffer23 (Cd1_Analog_Buffer23.2 Cd2_Analog_Buffer23.2 U1_Analog_Buffer23.4), Attenuator (18 pins), Stripline_Driver (17 pins), Bias_Current_Source (Cd41.2 Cd42.2 Rbias.2 U1.4)
VDD5v: Top (26 pins), LDO (CdL29.2 CdL30.2 CdL31.2 J_VCCboard.2), CM Voltage Generator (6 pins), Level_Shifter_Clk (J_VCCB_Level_Shifter_Clk.2), Analog_Buffer1 (Cd1_Analog_Buffer1.1 Cd2_Analog_Buffer1.1 U1_Analog_Buffer1.8), Analog_Buffer2 (Cd1_Analog_Buffer2.1 Cd2_Analog_Buffer2.1 U1_Analog_Buffer2.8), Analog_Buffer3 (Cd1_Analog_Buffer3.1 Cd2_Analog_Buffer3.1 U1_Analog_Buffer3.8), Analog_Buffer4 (Cd1_Analog_Buffer4.1 Cd2_Analog_Buffer4.1 U1_Analog_Buffer4.8), Analog_Buffer5 (Cd1_Analog_Buffer5.1 Cd2_Analog_Buffer5.1 U1_Analog_Buffer5.8), Analog_Buffer6 (Cd1_Analog_Buffer6.1 Cd2_Analog_Buffer6.1 U1_Analog_Buffer6.8), Analog_Buffer7 (Cd1_Analog_Buffer7.1 Cd2_Analog_Buffer7.1 U1_Analog_Buffer7.8), Analog_Buffer8 (Cd1_Analog_Buffer8.1 Cd2_Analog_Buffer8.1 U1_Analog_Buffer8.8), Analog_Buffer9 (Cd1_Analog_Buffer9.1 Cd2_Analog_Buffer9.1 U1_Analog_Buffer9.8), Analog_Buffer10 (Cd1_Analog_Buffer10.1 Cd2_Analog_Buffer10.1 U1_Analog_Buffer10.8), Analog_Buffer11 (Cd1_Analog_Buffer11.1 Cd2_Analog_Buffer11.1 U1_Analog_Buffer11.8), Analog_Buffer12 (Cd1_Analog_Buffer12.1 Cd2_Analog_Buffer12.1 U1_Analog_Buffer12.8), Analog_Buffer13 (Cd1_Analog_Buffer13.1 Cd2_Analog_Buffer13.1 U1_Analog_Buffer13.8), Analog_Buffer14 (Cd1_Analog_Buffer14.1 Cd2_Analog_Buffer14.1 U1_Analog_Buffer14.8), Analog_Buffer15 (Cd1_Analog_Buffer15.1 Cd2_Analog_Buffer15.1 U1_Analog_Buffer15.8), Analog_Buffer16 (Cd1_Analog_Buffer16.1 Cd2_Analog_Buffer16.1 U1_Analog_Buffer16.8), Analog_Buffer17 (Cd1_Analog_Buffer17.1 Cd2_Analog_Buffer17.1 U1_Analog_Buffer17.8), Analog_Buffer18 (Cd1_Analog_Buffer18.1 Cd2_Analog_Buffer18.1 U1_Analog_Buffer18.8), Analog_Buffer19 (Cd1_Analog_Buffer19.1 Cd2_Analog_Buffer19.1 U1_Analog_Buffer19.8), Analog_Buffer20 (Cd1_Analog_Buffer20.1 Cd2_Analog_Buffer20.1 U1_Analog_Buffer20.8), Analog_Buffer21 (Cd1_Analog_Buffer21.1 Cd2_Analog_Buffer21.1 U1_Analog_Buffer21.8), Analog_Buffer22 (Cd1_Analog_Buffer22.1 Cd2_Analog_Buffer22.1 U1_Analog_Buffer22.8), Analog_Buffer23 (Cd1_Analog_Buffer23.1 Cd2_Analog_Buffer23.1 U1_Analog_Buffer23.8), Attenuator (6 pins), Level_Shifter_Stripline (J_VCCB_Level_Shifter_Stripline.2), Bias_Current_Source (12 pins)
A_IN1: Top (J_Ain1.1), Analog_Buffer1 (J1_Analog_Buffer1.1 U1_Analog_Buffer1.3)
A_IN2: Top (J_Ain2.1), Analog_Buffer2 (J1_Analog_Buffer2.1 U1_Analog_Buffer2.3)
A_IN3: Top (J_Ain3.1), Analog_Buffer3 (J1_Analog_Buffer3.1 U1_Analog_Buffer3.3)
A_IN4: Top (J_Ain4.1), Analog_Buffer4 (J1_Analog_Buffer4.1 U1_Analog_Buffer4.3)
A_IN5: Top (J_Ain5.1), Analog_Buffer5 (J1_Analog_Buffer5.1 U1_Analog_Buffer5.3)
A_IN6: Top (J_Ain6.1), Analog_Buffer6 (J1_Analog_Buffer6.1 U1_Analog_Buffer6.3)
A_IN7: Top (J_Ain7.1), Analog_Buffer7 (J1_Analog_Buffer7.1 U1_Analog_Buffer7.3)
A_IN8: Top (J_Ain8.1), Analog_Buffer8 (J1_Analog_Buffer8.1 U1_Analog_Buffer8.3)
A_IN9: Top (J_Ain9.1), Analog_Buffer9 (J1_Analog_Buffer9.1 U1_Analog_Buffer9.3)
A_IN10: Top (J_Ain10.1), Analog_Buffer10 (J1_Analog_Buffer10.1 U1_Analog_Buffer10.3)
A_IN11: Top (J_Ain11.1), Analog_Buffer11 (J1_Analog_Buffer11.1 U1_Analog_Buffer11.3)
A_IN12: Top (J_Ain12.1), Analog_Buffer12 (J1_Analog_Buffer12.1 U1_Analog_Buffer12.3)
A_IN13: Top (J_Ain13.1), Analog_Buffer13 (J1_Analog_Buffer13.1 U1_Analog_Buffer13.3)
A_IN14: Top (J_Ain14.1), Analog_Buffer14 (J1_Analog_Buffer14.1 U1_Analog_Buffer14.3)
A_IN15: Top (J_Ain15.1), Analog_Buffer15 (J1_Analog_Buffer15.1 U1_Analog_Buffer15.3)
A_IN16: Top (J_Ain16.1), Analog_Buffer16 (J1_Analog_Buffer16.1 U1_Analog_Buffer16.3)
A_IN17: Top (J_Ain17.1), Analog_Buffer17 (J1_Analog_Buffer17.1 U1_Analog_Buffer17.3)
A_IN18: Top (J_Ain18.1), Analog_Buffer18 (J1_Analog_Buffer18.1 U1_Analog_Buffer18.3)
A_IN19: Top (J_Ain19.1), Analog_Buffer19 (J1_Analog_Buffer19.1 U1_Analog_Buffer19.3)
A_IN20: Top (J_Ain20.1), Analog_Buffer20 (J1_Analog_Buffer20.1 U1_Analog_Buffer20.3)
A_IN21: Top (J_Ain21.1), Analog_Buffer21 (J1_Analog_Buffer21.1 U1_Analog_Buffer21.3)
A_IN22: Top (J_Ain22.1), Analog_Buffer22 (J1_Analog_Buffer22.1 U1_Analog_Buffer22.3)
A_IN23: Top (J_Ain23.1), Analog_Buffer23 (J1_Analog_Buffer23.1 U1_Analog_Buffer23.3)
A_OUT1: Top (J_Aout1.1), Analog_Buffer1 (J2_Analog_Buffer1.1 U1_Analog_Buffer1.1 U1_Analog_Buffer1.2)
A_OUT2: Top (J_Aout2.1), Analog_Buffer2 (J2_Analog_Buffer2.1 U1_Analog_Buffer2.1 U1_Analog_Buffer2.2)
A_OUT3: Top (J_Aout3.1), Analog_Buffer3 (J2_Analog_Buffer3.1 U1_Analog_Buffer3.1 U1_Analog_Buffer3.2)
A_OUT4: Top (J_Aout4.1), Analog_Buffer4 (J2_Analog_Buffer4.1 U1_Analog_Buffer4.1 U1_Analog_Buffer4.2)
A_OUT5: Top (J_Aout5.1), Analog_Buffer5 (J2_Analog_Buffer5.1 U1_Analog_Buffer5.1 U1_Analog_Buffer5.2)
A_OUT6: Top (J_Aout6.1), Analog_Buffer6 (J2_Analog_Buffer6.1 U1_Analog_Buffer6.1 U1_Analog_Buffer6.2)
A_OUT7: Top (J_Aout7.1), Analog_Buffer7 (J2_Analog_Buffer7.1 U1_Analog_Buffer7.1 U1_Analog_Buffer7.2)
A_OUT8: Top (J_Aout8.1), Analog_Buffer8 (J2_Analog_Buffer8.1 U1_Analog_Buffer8.1 U1_Analog_Buffer8.2)
A_OUT9: Top (J_Aout9.1), Analog_Buffer9 (J2_Analog_Buffer9.1 U1_Analog_Buffer9.1 U1_Analog_Buffer9.2)
A_OUT10: Top (J_Aout10.1), Analog_Buffer10 (J2_Analog_Buffer10.1 U1_Analog_Buffer10.1 U1_Analog_Buffer10.2)
A_OUT11: Top (J_Aout11.1), Analog_Buffer11 (J2_Analog_Buffer11.1 U1_Analog_Buffer11.1 U1_Analog_Buffer11.2)
A_OUT12: Top (J_Aout12.1), Analog_Buffer12 (J2_Analog_Buffer12.1 U1_Analog_Buffer12.1 U1_Analog_Buffer12.2)
A_OUT13: Top (J_Aout13.1), Analog_Buffer13 (J2_Analog_Buffer13.1 U1_Analog_Buffer13.1 U1_Analog_Buffer13.2)
A_OUT14: Top (J_Aout14.1), Analog_Buffer14 (J2_Analog_Buffer14.1 U1_Analog_Buffer14.1 U1_Analog_Buffer14.2)
A_OUT15: Top (J_Aout15.1), Analog_Buffer15 (J2_Analog_Buffer15.1 U1_Analog_Buffer15.1 U1_Analog_Buffer15.2)
A_OUT16: Top (J_Aout16.1), Analog_Buffer16 (J2_Analog_Buffer16.1 U1_Analog_Buffer16.1 U1_Analog_Buffer16.2)
A_OUT17: Top (J_Aout17.1), Analog_Buffer17 (J2_Analog_Buffer17.1 U1_Analog_Buffer17.1 U1_Analog_Buffer17.2)
A_OUT18: Top (J_Aout18.1), Analog_Buffer18 (J2_Analog_Buffer18.1 U1_Analog_Buffer18.1 U1_Analog_Buffer18.2)
A_OUT19: Top (J_Aout19.1), Analog_Buffer19 (J2_Analog_Buffer19.1 U1_Analog_Buffer19.1 U1_Analog_Buffer19.2)
A_OUT20: Top (J_Aout20.1), Analog_Buffer20 (J2_Analog_Buffer20.1 U1_Analog_Buffer20.1 U1_Analog_Buffer20.2)
A_OUT21: Top (J_Aout21.1), Analog_Buffer21 (J2_Analog_Buffer21.1 U1_Analog_Buffer21.1 U1_Analog_Buffer21.2)
A_OUT22: Top (J_Aout22.1), Analog_Buffer22 (J2_Analog_Buffer22.1 U1_Analog_Buffer22.1 U1_Analog_Buffer22.2)
A_OUT23: Top (J_Aout23.1), Analog_Buffer23 (J2_Analog_Buffer23.1 U1_Analog_Buffer23.1 U1_Analog_Buffer23.2)
B_IN1: Top (J_Bin1.1), Analog_Buffer1 (J3_Analog_Buffer1.1 U1_Analog_Buffer1.5)
B_IN2: Top (J_Bin2.1), Analog_Buffer2 (J3_Analog_Buffer2.1 U1_Analog_Buffer2.5)
B_IN3: Top (J_Bin3.1), Analog_Buffer3 (J3_Analog_Buffer3.1 U1_Analog_Buffer3.5)
B_IN4: Top (J_Bin4.1), Analog_Buffer4 (J3_Analog_Buffer4.1 U1_Analog_Buffer4.5)
B_IN5: Top (J_Bin5.1), Analog_Buffer5 (J3_Analog_Buffer5.1 U1_Analog_Buffer5.5)
B_IN6: Top (J_Bin6.1), Analog_Buffer6 (J3_Analog_Buffer6.1 U1_Analog_Buffer6.5)
B_IN7: Top (J_Bin7.1), Analog_Buffer7 (J3_Analog_Buffer7.1 U1_Analog_Buffer7.5)
B_IN8: Top (J_Bin8.1), Analog_Buffer8 (J3_Analog_Buffer8.1 U1_Analog_Buffer8.5)
B_IN9: Top (J_Bin9.1), Analog_Buffer9 (J3_Analog_Buffer9.1 U1_Analog_Buffer9.5)
B_IN10: Top (J_Bin10.1), Analog_Buffer10 (J3_Analog_Buffer10.1 U1_Analog_Buffer10.5)
B_IN11: Top (J_Bin11.1), Analog_Buffer11 (J3_Analog_Buffer11.1 U1_Analog_Buffer11.5)
B_IN12: Top (J_Bin12.1), Analog_Buffer12 (J3_Analog_Buffer12.1 U1_Analog_Buffer12.5)
B_IN13: Top (J_Bin13.1), Analog_Buffer13 (J3_Analog_Buffer13.1 U1_Analog_Buffer13.5)
B_IN14: Top (J_Bin14.1), Analog_Buffer14 (J3_Analog_Buffer14.1 U1_Analog_Buffer14.5)
B_IN15: Top (J_Bin15.1), Analog_Buffer15 (J3_Analog_Buffer15.1 U1_Analog_Buffer15.5)
B_IN16: Top (J_Bin16.1), Analog_Buffer16 (J3_Analog_Buffer16.1 U1_Analog_Buffer16.5)
B_IN17: Top (J_Bin17.1), Analog_Buffer17 (J3_Analog_Buffer17.1 U1_Analog_Buffer17.5)
B_IN18: Top (J_Bin18.1), Analog_Buffer18 (J3_Analog_Buffer18.1 U1_Analog_Buffer18.5)
B_IN19: Top (J_Bin19.1), Analog_Buffer19 (J3_Analog_Buffer19.1 U1_Analog_Buffer19.5)
B_IN20: Top (J_Bin20.1), Analog_Buffer20 (J3_Analog_Buffer20.1 U1_Analog_Buffer20.5)
B_IN21: Top (J_Bin21.1), Analog_Buffer21 (J3_Analog_Buffer21.1 U1_Analog_Buffer21.5)
B_IN22: Top (J_Bin22.1), Analog_Buffer22 (J3_Analog_Buffer22.1 U1_Analog_Buffer22.5)
B_IN23: Top (J_Bin23.1), Analog_Buffer23 (J3_Analog_Buffer23.1 U1_Analog_Buffer23.5)
B_OUT1: Top (J_Bout1.1), Analog_Buffer1 (J4_Analog_Buffer1.1 U1_Analog_Buffer1.6 U1_Analog_Buffer1.7)
B_OUT2: Top (J_Bout2.1), Analog_Buffer2 (J4_Analog_Buffer2.1 U1_Analog_Buffer2.6 U1_Analog_Buffer2.7)
B_OUT3: Top (J_Bout3.1), Analog_Buffer3 (J4_Analog_Buffer3.1 U1_Analog_Buffer3.6 U1_Analog_Buffer3.7)
B_OUT4: Top (J_Bout4.1), Analog_Buffer4 (J4_Analog_Buffer4.1 U1_Analog_Buffer4.6 U1_Analog_Buffer4.7)
B_OUT5: Top (J_Bout5.1), Analog_Buffer5 (J4_Analog_Buffer5.1 U1_Analog_Buffer5.6 U1_Analog_Buffer5.7)
B_OUT6: Top (J_Bout6.1), Analog_Buffer6 (J4_Analog_Buffer6.1 U1_Analog_Buffer6.6 U1_Analog_Buffer6.7)
B_OUT7: Top (J_Bout7.1), Analog_Buffer7 (J4_Analog_Buffer7.1 U1_Analog_Buffer7.6 U1_Analog_Buffer7.7)
B_OUT8: Top (J_Bout8.1), Analog_Buffer8 (J4_Analog_Buffer8.1 U1_Analog_Buffer8.6 U1_Analog_Buffer8.7)
B_OUT9: Top (J_Bout9.1), Analog_Buffer9 (J4_Analog_Buffer9.1 U1_Analog_Buffer9.6 U1_Analog_Buffer9.7)
B_OUT10: Top (J_Bout10.1), Analog_Buffer10 (J4_Analog_Buffer10.1 U1_Analog_Buffer10.6 U1_Analog_Buffer10.7)
B_OUT11: Top (J_Bout11.1), Analog_Buffer11 (J4_Analog_Buffer11.1 U1_Analog_Buffer11.6 U1_Analog_Buffer11.7)
B_OUT12: Top (J_Bout12.1), Analog_Buffer12 (J4_Analog_Buffer12.1 U1_Analog_Buffer12.6 U1_Analog_Buffer12.7)
B_OUT13: Top (J_Bout13.1), Analog_Buffer13 (J4_Analog_Buffer13.1 U1_Analog_Buffer13.6 U1_Analog_Buffer13.7)
B_OUT14: Top (J_Bout14.1), Analog_Buffer14 (J4_Analog_Buffer14.1 U1_Analog_Buffer14.6 U1_Analog_Buffer14.7)
B_OUT15: Top (J_Bout15.1), Analog_Buffer15 (J4_Analog_Buffer15.1 U1_Analog_Buffer15.6 U1_Analog_Buffer15.7)
B_OUT16: Top (J_Bout16.1), Analog_Buffer16 (J4_Analog_Buffer16.1 U1_Analog_Buffer16.6 U1_Analog_Buffer16.7)
B_OUT17: Top (J_Bout17.1), Analog_Buffer17 (J4_Analog_Buffer17.1 U1_Analog_Buffer17.6 U1_Analog_Buffer17.7)
B_OUT18: Top (J_Bout18.1), Analog_Buffer18 (J4_Analog_Buffer18.1 U1_Analog_Buffer18.6 U1_Analog_Buffer18.7)
B_OUT19: Top (J_Bout19.1), Analog_Buffer19 (J4_Analog_Buffer19.1 U1_Analog_Buffer19.6 U1_Analog_Buffer19.7)
B_OUT20: Top (J_Bout20.1), Analog_Buffer20 (J4_Analog_Buffer20.1 U1_Analog_Buffer20.6 U1_Analog_Buffer20.7)
B_OUT21: Top (J_Bout21.1), Analog_Buffer21 (J4_Analog_Buffer21.1 U1_Analog_Buffer21.6 U1_Analog_Buffer21.7)
B_OUT22: Top (J_Bout22.1), Analog_Buffer22 (J4_Analog_Buffer22.1 U1_Analog_Buffer22.6 U1_Analog_Buffer22.7)
B_OUT23: Top (J_Bout23.1), Analog_Buffer23 (J4_Analog_Buffer23.1 U1_Analog_Buffer23.6 U1_Analog_Buffer23.7)
Clk_ref_1.8: Top (R054.2), Level_Shifter_Clk (J_Clk1.8_Level_Shifter_Clk.2)
Clk_strip5v: Stripline_Driver (U10.7 U12.1), Level_Shifter_Stripline (J_Clk5_Level_Shifter_Stripline.1)
Clk_stripe: Top (P3.36), Level_Shifter_Stripline (J_Clk1.8_Level_Shifter_Stripline.2)
DGND: Top (34 pins), Level_Shifter_Clk (6 pins), Level_Shifter_Stripline (6 pins)
DVDD: Top (5 pins), LDO (CdL15a.1 CdL15b.1 CdL15c.1 FB15.2)
ESDVDD: Top (P2.6), LDO (CdL16a.1 CdL16b.1 CdL16c.1 FB16.2)
FPGAVDD: Top (5 pins), Level_Shifter_Clk (J_VCCA_Level_Shifter_Clk.1), Level_Shifter_Stripline (J_VCCA_Level_Shifter_Stripline.1)
NetJ_att1_1: Top (J_att1.1), Attenuator (U4.1 U4.2)
NetJ_att2_1: Top (J_att2.1), Attenuator (U4.6 U4.7)
NetJ_att3_1: Top (J_att3.1), Attenuator (U5.1 U5.2)
NetJ_att4_1: Top (J_att4.1), Attenuator (U5.6 U5.7)
NetU1_2: Top (Vbias2.1), Bias_Current_Source (U1.2)
R1: Top (J_R1.3 Jr1.1 P20.6), Bias_Current_Source (M2.6)
R2: Top (J_R2.3 Jr2.1 P20.5), Bias_Current_Source (M2.4)
R3: Top (J_R3.3 Jr3.1 P20.8), Bias_Current_Source (M3.6)
R4: Top (J_R4.3 Jr4.1 P20.7), Bias_Current_Source (M3.4)
R5: Top (J_R5.3 Jr5.1 P20.18), Bias_Current_Source (M4.6)
R6: Top (J_R6.3 Jr6.1 P20.17), Bias_Current_Source (M4.4)
R7: Top (J_R7.3 Jr7.1 P20.20), Bias_Current_Source (M5.6)
R8: Top (J_R8.3 Jr8.1 P20.19), Bias_Current_Source (M5.4)
SVDD: Top (P2.3 P2.4), LDO (CdL11a.1 CdL11b.1 CdL11c.1 FB11.2)
V_fH: Top (V_fH.1), Stripline_Driver (R1.2 U10.2 U11.3)
Vcmi: Top (P3.1), CM Voltage Generator (J_cmi.1 J_Vcmi.2)
Vcmo: Top (P3.2), CM Voltage Generator (J_cmo.1 J_Vcmo.2)
VDD_Bias: Top (P2.9 P3.7), LDO (CdL12a.1 CdL12b.1 CdL12c.1 FB12.2)
VDD_chip: LDO (7 pins), CM Voltage Generator (Q_cmi.1 Q_cmo.1 R_cmi1.2 R_cmo1.2)
VDD_DSM: Top (P1.36 P3.5), LDO (CdL14a.1 CdL14b.1 CdL14c.1 FB14.2), CM Voltage Generator (Q+.1 Q-.1 R_ref1+.2 R_ref1-.2)
VDD_IA: Top (P1.37 P3.6), LDO (CdL13a.1 CdL13b.1 CdL13c.1 FB13.2)
VDDD: Top (J_VDDD.2), Stripline_Driver (10 pins)
VH0: Top (J_VH.1), Stripline_Driver (U12.2 U12.15)
Vref+: Top (P3.3), CM Voltage Generator (J_ref+.1 J_Vref+.2)
Vref-: Top (P3.4), CM Voltage Generator (J_ref-.1 J_Vref-.2)
VSSS: Top (Cd02.2 Cd04.2 VSSS.1), Stripline_Driver (9 pins)